# EAGLE design LightSensorDigital (EAGLE 9.6.2)
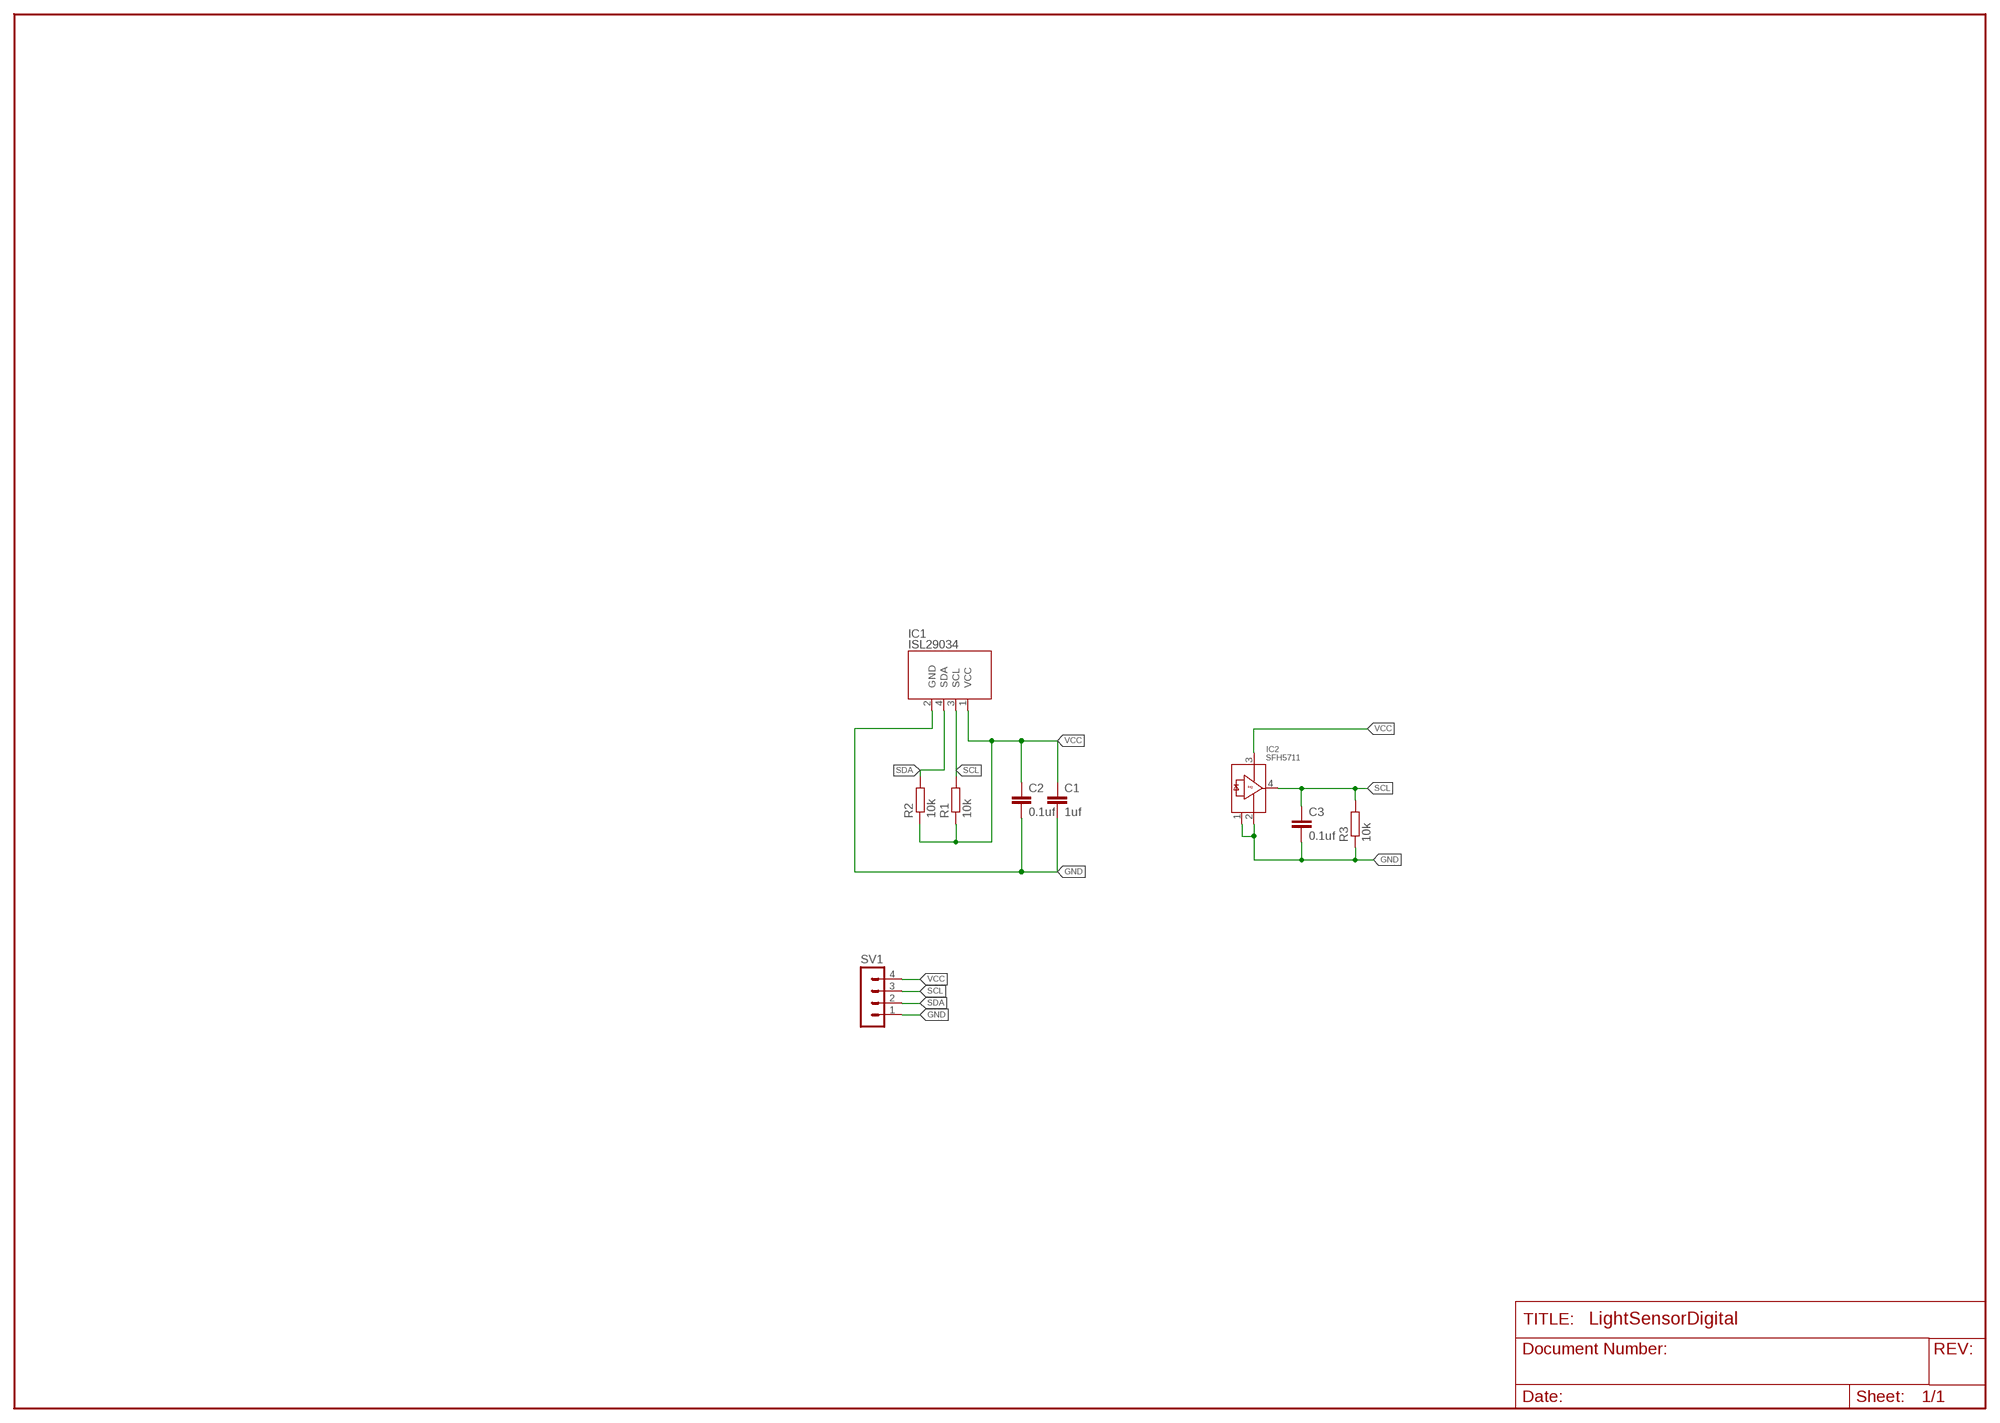
[diagram p0: schematic, sheet 1]

## Parts
C1  1uf  SMD_C0603  [0603]
C2  0.1uf  SMD_C0603  [0603]
C3  0.1uf  SMD_C0603  [0603]
IC1  ISL29034  [ISL29034]
IC2  SFH5711  [SFH5711]
R1  10k  SMD_R0603  [0603]
R2  10k  SMD_R0603  [0603]
R3  10k  SMD_R0603  [0603]
SV1  MA04-1  [MA04-1]

## Nets
GND: C1.2 C2.2 C3.2 IC1.2(GND) IC2.1 IC2.2 R3.1 SV1.1
SCL: C3.1 IC1.3(SCL) IC2.4 R1.2 R3.2 SV1.3
SDA: IC1.4(SDA) R2.2 SV1.2
VCC: C1.1 C2.1 IC1.1(VCC) IC2.3 R1.1 R2.1 SV1.4

## Library data of the parts
C1-C3 = passive_components:SMD_C
IC1 = my_IC:ISL29034
IC2 = SFH5711:SFH5711; AVAILABILITY: Unavailable; DESCRIPTION: Optical Sensor Ambient 555nm Current 4-SMD, No Lead; MF: OSRAM Opto; MP: SFH5711; PACKAGE: SMD-4 OSRAM Opto; PRICE: None
R1-R3 = passive_components:SMD_R
SV1 = con-lstb:MA04-1: PIN HEADER; OC_FARNELL: unknown; OC_NEWARK: unknown

## Board
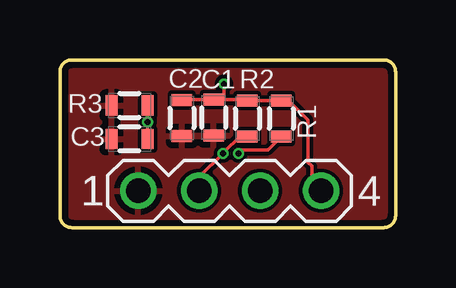
[diagram p1: board, top side]
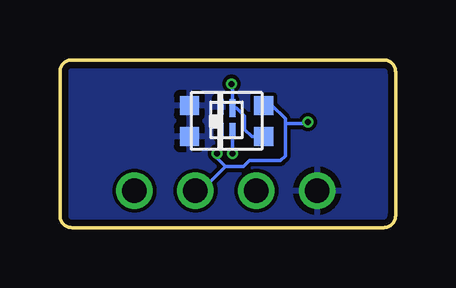
[diagram p2: board, bottom side, seen from below]

Size 14 x 7 mm. Coordinates in mm from the lower left corner, seen from the top.
Outline: 0.5,0 13.5,0 arc90 14,0.5 14,6.5 arc90 13.5,7 0.5,7 arc90 0,6.5 0,0.5 arc90 0.5,0
Copper layers (1*16): Top 0.035mm / dielectric 0.15mm / Bottom 0.035mm
Design rules "default *": minimum track width 6mil, minimum drill 0.25mm, track to track 6mil, track to pad 6mil, pad to pad 6mil, via to via 6mil, smd to smd 6mil, copper to edge 10mil, drill to drill 6mil, minimum pad ring 4mil, minimum via ring 4mil, stop-mask expansion 4mil, vias tented up to drill 10mil, thermal gap 10mil

### Footprints (pad centres in the part's own frame; a part is rotated, then mirrored left to right if it is on the bottom)
0603 = smd 0.85 x 0.5: 1 0,0.75; 2 0,-0.75
ISL29034 = smd 0.75 x 0.25: 1 -0.5,0.25 | smd 0.65 x 0.25: 2 -0.55,-0.25; 3 0.45,-0.25; 4 0.45,0.25
SFH5711 = smd 0.8 x 0.8: 1 -0.65,-1.55; 2 0.65,-1.55; 3 0.65,1.55; 4 -0.65,1.55
MA04-1 = drill 1.016: 1 -3.81,0; 2 -1.27,0; 3 1.27,0; 4 3.81,0

### Placement (x,y rotation side)
C1  6.41,4.59 0 top
C2  5.09,4.57 0 top
C3  2.9,3.7 270 top
IC1  7.05,4.49 270 bottom
IC2  7.05,4.45 270 bottom
R1  9.23,4.55 0 top
R2  7.82,4.55 0 top
R3  2.9,5.1 90 top
SV1  7.08,1.54 0 top

### Tracks (layer width: path | path; a pad name or v marks a point on that pad's centre or on a via)
GND
  pour Top: -4.9,6.7 19.05,6.7 22.7,3.05 17.6,-2.05 -4.7,-2.05 -5.4,-1.35 -5.4,6.2
  pour Bottom: -5.3,6.7 19.85,6.7 21,5.55 21,-0.9 19.75,-2.15 -4.6,-2.15 -5.7,-1.05 -5.7,6.3
SCL  (via drill 0.25)
  Top 0.152: R1.2 8.68,3.25 7.6,3.25 v7.45,3.1 7.5,3.05 | R3.2 v3.65,4.4 C3.1
  Bottom 0.152: IC1.3 7.3,3.25 v7.45,3.1 7.45,2.9 7.1,2.55 | 7.1,2.55 6.35,2.55 6.1,2.8 4.8,2.8 4.6,3 4.6,4.35 | IC2.4 5.15,5.1 4.6,4.55 4.6,4.35 | 4.6,4.35 3.7,4.35 v3.65,4.4 | 7.1,2.55 8.11,1.54 SV1.3
SDA  (via drill 0.25)
  Top 0.152: R2.2 7.5,3.8 6.85,3.15 v6.8,3.1 5.81,2.11 SV1.2
  Bottom 0.152: IC1.4 v6.8,3.1
VCC  (via drill 0.25)
  Top 0.152: 6.39,5.32 C1.1 | C2.1 5.11,5.34 C1.1 | C1.1 6.85,5.34 v6.85,6 | C1.1 7.78,5.34 R2.1 R1.1 9.54,5.3 10.34,4.5 10.34,2.73 10.5,2.57 10.5,1.93 SV1.4
  Bottom 0.152: v6.85,6 6.8,5.95 IC1.1 6.64,4.99 6.3,4.65 6.3,4.1 6,3.8 IC2.3